# Altium schematic sheet Pallette v0.5.SchDoc
size A3
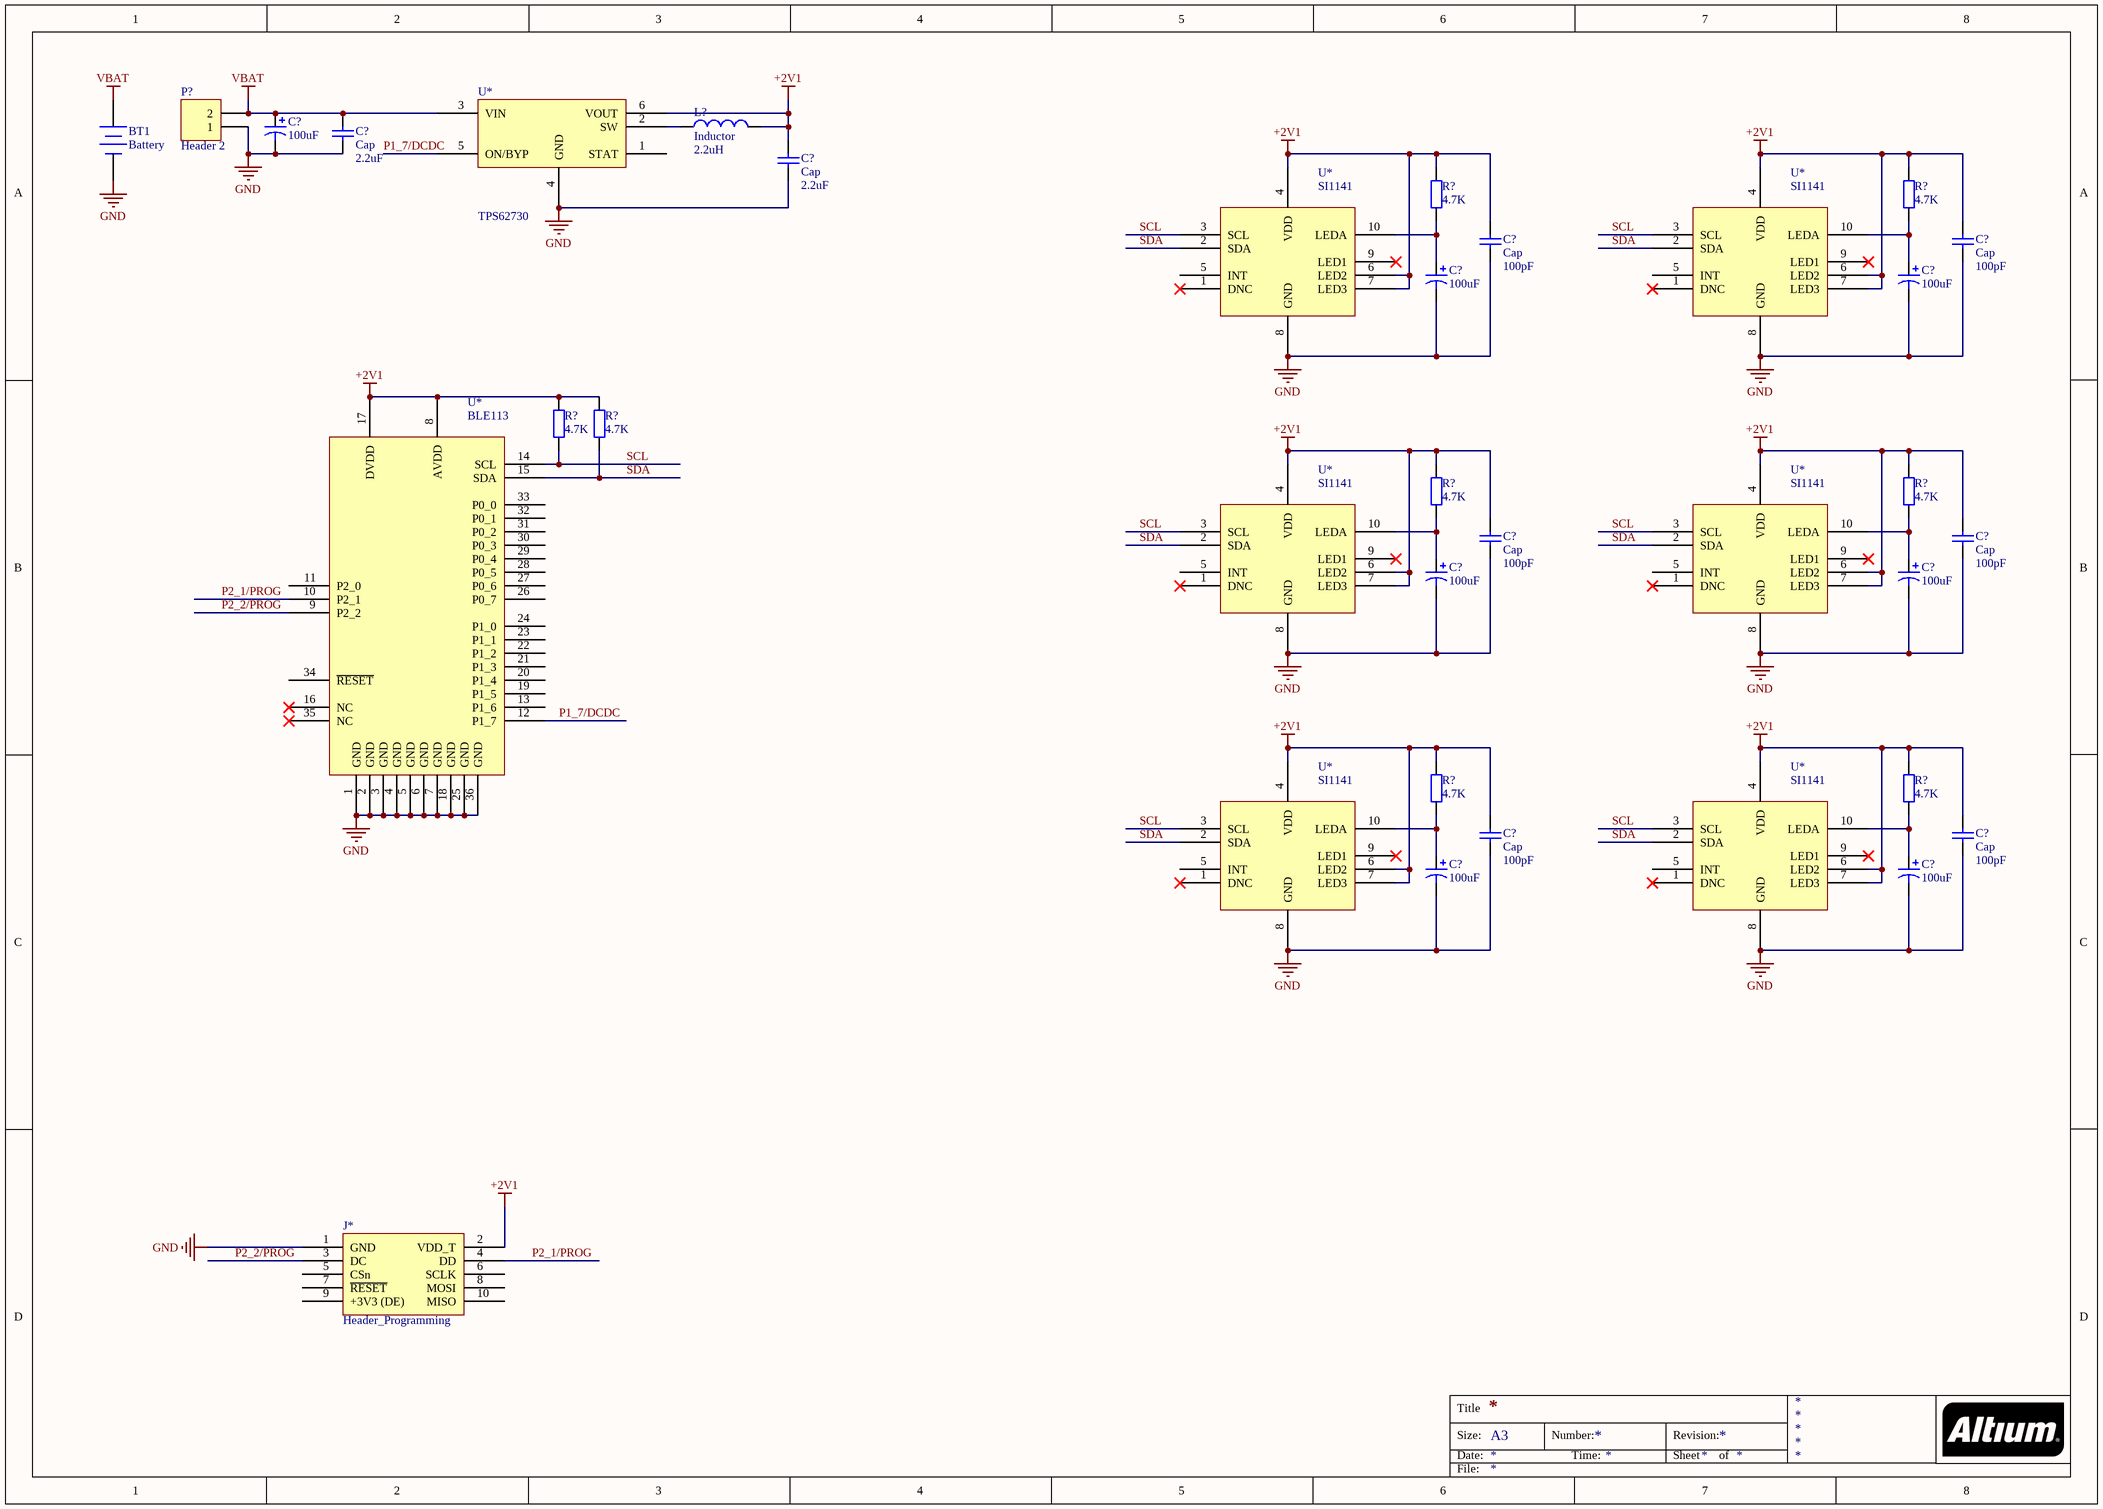
[diagram p0: Pallette v0.5.SchDoc]

## Parts
(Parts that share a designator on the sheet are numbered #1, #2 ... from top to bottom, then left to right.)
BT1  Battery
C?#1  value 100uF  (hidden comment: Cap Pol 100uF)
C?#2  Cap  value 2.2uF  [RAD-0.3]
C?#3  Cap  value 2.2uF  [RAD-0.3]
C?#4  Cap  value 100pF  [RAD-0.3]
C?#5  Cap  value 100pF  [RAD-0.3]
C?#6  value 100uF  (hidden comment: Cap Pol 100uF)
C?#7  value 100uF  (hidden comment: Cap Pol 100uF)
C?#8  Cap  value 100pF  [RAD-0.3]
C?#9  Cap  value 100pF  [RAD-0.3]
C?#10  value 100uF  (hidden comment: Cap Pol 100uF)
C?#11  value 100uF  (hidden comment: Cap Pol 100uF)
C?#12  Cap  value 100pF  [RAD-0.3]
C?#13  Cap  value 100pF  [RAD-0.3]
C?#14  value 100uF  (hidden comment: Cap Pol 100uF)
C?#15  value 100uF  (hidden comment: Cap Pol 100uF)
J*  Header_Programming
L?  Inductor  value 2.2uH  [0402-A]
P?  Header 2  [HDR1X2]
R?#1  value 4.7K  (hidden comment: Res)
R?#2  value 4.7K  (hidden comment: Res)
R?#3  value 4.7K  (hidden comment: Res)
R?#4  value 4.7K  (hidden comment: Res)
R?#5  value 4.7K  (hidden comment: Res)
R?#6  value 4.7K  (hidden comment: Res)
R?#7  value 4.7K  (hidden comment: Res)
R?#8  value 4.7K  (hidden comment: Res)
U*#1  TPS62730
U*#2  SI1141
U*#3  SI1141
U*#4  SI1141
U*#5  SI1141
U*#6  BLE113
U*#7  SI1141
U*#8  SI1141

## Nets
+2V1: C?#3.2 C?#4.2 C?#5.2 C?#8.2 C?#9.2 C?#12.2 C?#13.2 J*.2(VDD_T) L?.2 R?#1.2 R?#2.2 R?#3.2 R?#4.2 R?#5.2 R?#6.2 R?#7.2 R?#8.2 U*#1.6(VOUT) U*#2.4(VDD) U*#2.6(LED2) U*#2.7(LED3) U*#3.4(VDD) U*#3.6(LED2) U*#3.7(LED3) U*#4.4(VDD) U*#4.6(LED2) U*#4.7(LED3) U*#5.4(VDD) U*#5.6(LED2) U*#5.7(LED3) U*#6.8(AVDD) U*#6.17(DVDD) U*#7.4(VDD) U*#7.6(LED2) U*#7.7(LED3) U*#8.4(VDD) U*#8.6(LED2) U*#8.7(LED3)
GND: BT1.2(-) C?#1.2 C?#2.1 C?#3.1 C?#4.1 C?#5.1 C?#6.2 C?#7.2 C?#8.1 C?#9.1 C?#10.2 C?#11.2 C?#12.1 C?#13.1 C?#14.2 C?#15.2 J*.1(GND) P?.1 U*#1.4(GND) U*#2.8(GND) U*#3.8(GND) U*#4.8(GND) U*#5.8(GND) U*#6.1(GND) U*#6.2(GND) U*#6.3(GND) U*#6.4(GND) U*#6.5(GND) U*#6.6(GND) U*#6.7(GND) U*#6.18(GND) U*#6.25(GND) U*#6.36(GND) U*#7.8(GND) U*#8.8(GND)
VBAT: BT1.1(+) C?#1.1 C?#2.2 P?.2 U*#1.3(VIN)
P1_7/DCDC: U*#1.5(ON/BYP) U*#6.12(P1_7)
P2_1/PROG: J*.4(DD) U*#6.10(P2_1)
P2_2/PROG: J*.3(DC) U*#6.9(P2_2)
SCL: R?#3.1 U*#2.3(SCL) U*#3.3(SCL) U*#4.3(SCL) U*#5.3(SCL) U*#6.14(SCL) U*#7.3(SCL) U*#8.3(SCL)
SDA: R?#4.1 U*#2.2(SDA) U*#3.2(SDA) U*#4.2(SDA) U*#5.2(SDA) U*#6.15(SDA) U*#7.2(SDA) U*#8.2(SDA)
NetC?#6_1: C?#6.1 R?#1.1 U*#2.10(LEDA)
NetC?#7_1: C?#7.1 R?#2.1 U*#3.10(LEDA)
NetC?#10_1: C?#10.1 R?#5.1 U*#4.10(LEDA)
NetC?#11_1: C?#11.1 R?#6.1 U*#5.10(LEDA)
NetC?#14_1: C?#14.1 R?#7.1 U*#7.10(LEDA)
NetC?#15_1: C?#15.1 R?#8.1 U*#8.10(LEDA)
NetL?_1: L?.1 U*#1.2(SW)

Not connected (* = marked no-connect by the designer): J* 5(CSn) 6(SCLK) 7(~{RESET}) 8(MOSI) 9(+3V3_(DE)) 10(MISO); U*#1 1(STAT); U*#2 1(DNC)* 5(INT) 9(LED1)*; U*#3 1(DNC)* 5(INT) 9(LED1)*; U*#4 1(DNC)* 5(INT) 9(LED1)*; U*#5 1(DNC)* 5(INT) 9(LED1)*; U*#6 11(P2_0) 13(P1_6) 16(NC)* 19(P1_5) 20(P1_4) 21(P1_3) 22(P1_2) 23(P1_1) 24(P1_0) 26(P0_7) 27(P0_6) 28(P0_5) 29(P0_4) 30(P0_3) 31(P0_2) 32(P0_1) 33(P0_0) 34(~{RESET}) 35(NC)*; U*#7 1(DNC)* 5(INT) 9(LED1)*; U*#8 1(DNC)* 5(INT) 9(LED1)*

## Notes on the sheet
- Title
- Size:
- Date:
- A3
- Number:
- Time:
- Revision:
- Sheet
- of
- File:

## Library data of the parts
BT1 = Battery: Multicell Battery; Published: 24-Mar-1999; LatestRevisionDate: 17-Jul-2002; LatestRevisionNote: Re-released for DXP Platform.; PackageReference: BAT-2; Publisher: Altium Limited; PackageDescription: Battery; 2 Leads
C?#1 C?#6 C?#7 C?#10 C?#11 C?#14 C?#15 = Cap Pol 100uF: 100uF Polarized Capacitor; Published: 8-Jun-2000; LatestRevisionDate: 17-Jul-2002; LatestRevisionNote: Re-released for DXP Platform.; PackageReference: POLAR0.8; Publisher: Altium Limited; PackageDescription: Polarized Capacitor; 2 Leads
C?#2-C?#5 C?#8 C?#9 C?#12 C?#13 = Cap: Capacitor; Published: 8-Jun-2000; LatestRevisionDate: 17-Jul-2002; LatestRevisionNote: Re-released for DXP Platform.; PackageReference: RAD-0.3; Publisher: Altium Limited; PackageDescription: Radial Cap, Thru-Hole; 2 Leads; 0.3 in Pin Spacing
L? = Inductor: Code_IEC: 1005; Published: 8-Jun-2000; LatestRevisionDate: 29-May-2009; LatestRevisionNote: IPC-7351 Footprint Added.; PackageReference: 0402-A; Publisher: Altium Limited; PackageDescription: Chip Inductor; Code_JEITA: 0402
P? = Header 2: Header, 2-Pin; LatestRevisionDate: 17-Jul-2002; LatestRevisionNote: Re-released for DXP Platform.; Publisher: Altium Limited
R?#1-R?#8 = Res: Resistor 4.7K; Published: 8-Jun-2000; LatestRevisionDate: 17-Jul-2002; LatestRevisionNote: Re-released for DXP Platform.; PackageReference: AXIAL-0.4; Publisher: Altium Limited; PackageDescription: Axial Device, Thru-Hole; 2 Leads; 0.4 in Pin Spacing
U*#1 = TPS62730: 2.1V Step-Down Converter
U*#2-U*#5 U*#7 U*#8 = SI1141: IR Light Sensor
U*#6 = BLE113: Bluetooth Smart Module